# Altium project MRTRUMAN.PrjPcb (part 2 of 4)

## Sheet 03 POWER.SchDoc
size 381 x 228 mm
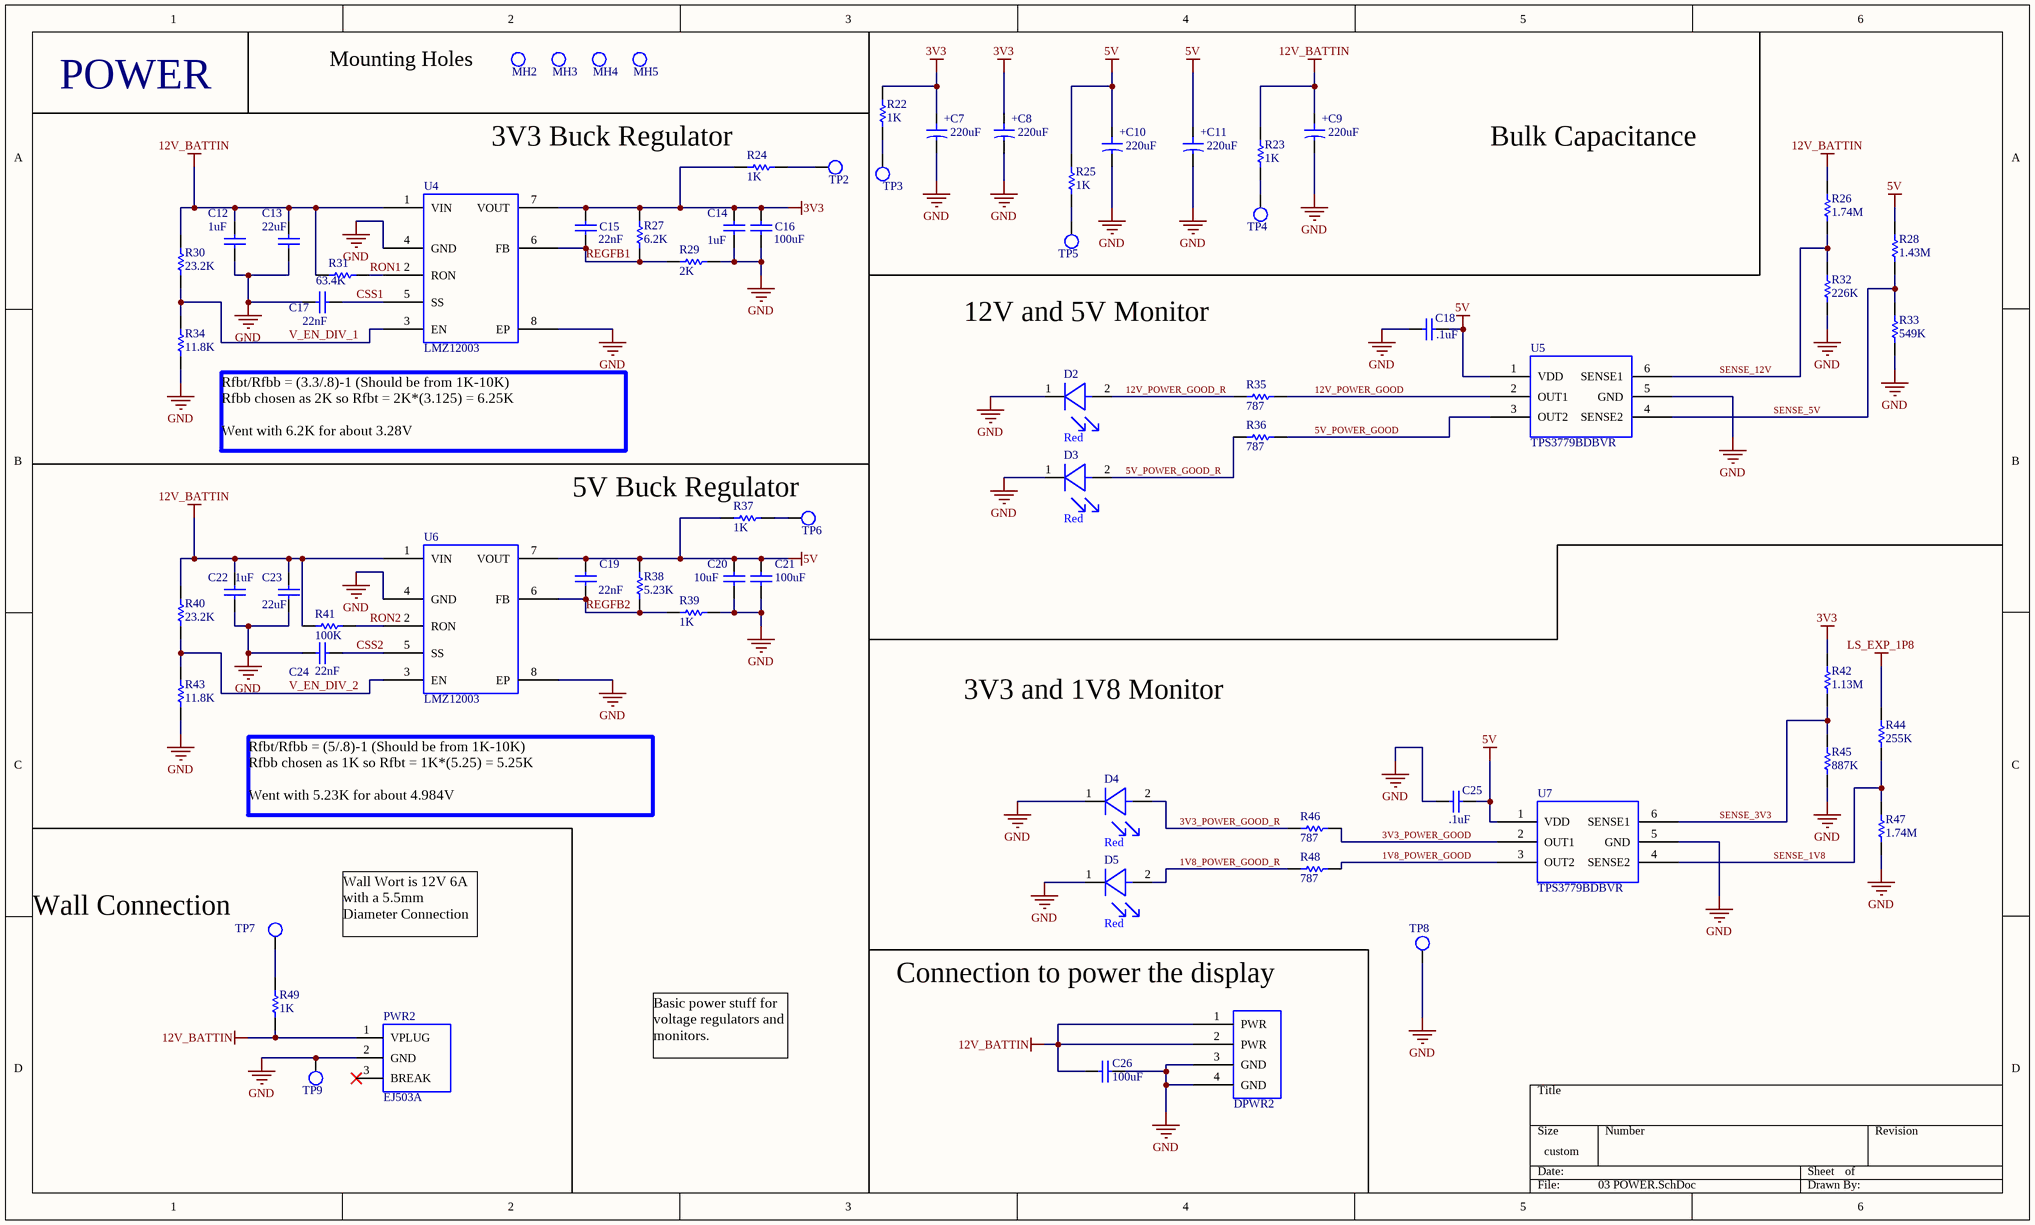
[diagram p2: 03 POWER.SchDoc]

### Parts
C7  Capacitance: 220uF  [CAP_RADIAL]  (hidden comment: CAP ALUM 220UF 20% 25V SMD)
C8  Capacitance: 220uF  [CAP_RADIAL]  (hidden comment: CAP ALUM 220UF 20% 25V SMD)
C9  Capacitance: 220uF  [CAP_RADIAL]  (hidden comment: CAP ALUM 220UF 20% 25V SMD)
C10  Capacitance: 220uF  [CAP_RADIAL]  (hidden comment: CAP ALUM 220UF 20% 25V SMD)
C11  Capacitance: 220uF  [CAP_RADIAL]  (hidden comment: CAP ALUM 220UF 20% 25V SMD)
C12  value 1uF  [CAPC2012X135N]  (hidden comment: CAP_0805_1u_100V)
C13  value 22uF  [CAPC2012X135N]  (hidden comment: CAP_0805_22u_25V)
C14  value 1uF  [CAPC2012X135N]  (hidden comment: CAP_0805_1u_100V)
C15  value 22nF  [CAPC2012X135N]  (hidden comment: CAP_0805_m22n)
C16  value 100uF  [FP_1210]  (hidden comment: CAP_1210_100u_10V)
C17  value 22nF  [CAPC2012X135N]  (hidden comment: CAP_0805_m22n)
C18  value .1uF  [CAPC2012X135N]  (hidden comment: CAP_0805_.1u_250V)
C19  value 22nF  [CAPC2012X135N]  (hidden comment: CAP_0805_m22n)
C20  value 10uF  [CAPC2012X135N]  (hidden comment: CAP_0805_10u_16V)
C21  value 100uF  [FP_1210]  (hidden comment: CAP_1210_100u_10V)
C22  value 1uF  [CAPC2012X135N]  (hidden comment: CAP_0805_1u_100V)
C23  value 22uF  [CAPC2012X135N]  (hidden comment: CAP_0805_22u_25V)
C24  value 22nF  [CAPC2012X135N]  (hidden comment: CAP_0805_m22n)
C25  value .1uF  [CAPC2012X135N]  (hidden comment: CAP_0805_.1u_250V)
C26  value 100uF  [FP_1210]  (hidden comment: CAP_1210_100u_10V)
D2  Color: Red  [POWERLED_FP]  (hidden comment: LED_RED_636nm)
D3  Color: Red  [POWERLED_FP]  (hidden comment: LED_RED_636nm)
D4  Color: Red  [POWERLED_FP]  (hidden comment: LED_RED_636nm)
D5  Color: Red  [POWERLED_FP]  (hidden comment: LED_RED_636nm)
DPWR2  Display_Power  [PHOENIX_4POS_1935187]  (value not drawn)
MH2  MOUNTINGHOLE  [MOUNTINGHOLE]  (value not drawn)
MH3  MOUNTINGHOLE  [MOUNTINGHOLE]  (value not drawn)
MH4  MOUNTINGHOLE  [MOUNTINGHOLE]  (value not drawn)
MH5  MOUNTINGHOLE  [MOUNTINGHOLE]  (value not drawn)
PWR2  EJ503A  [BARRELJACK]
R22  RES_0805_1K  [RES0805]  (value not drawn)
R23  RES_0805_1K  [RES0805]  (value not drawn)
R24  RES_0805_1K  [RES0805]  (value not drawn)
R25  RES_0805_1K  [RES0805]  (value not drawn)
R26  RES_0805_1.74M  [RES0805]  (value not drawn)
R27  RES_6.2K  [RES0805]  (value not drawn)
R28  RES_1.43M  [RES0805]  (value not drawn)
R29  RES_0805_2K  [RES0805]  (value not drawn)
R30  RES_0805_23.2K  [RES0805]  (value not drawn)
R31  RES_63.4K  [RES0805]  (value not drawn)
R32  RES_0805_226K  [RES0805]  (value not drawn)
R33  RES_549K  [RES0805]  (value not drawn)
R34  RES_0805_11.8K  [RES0805]  (value not drawn)
R35  RES_787  [RES0805]  (value not drawn)
R36  RES_787  [RES0805]  (value not drawn)
R37  RES_0805_1K  [RES0805]  (value not drawn)
R38  RES_5.23K  [RES0805]  (value not drawn)
R39  RES_0805_1K  [RES0805]  (value not drawn)
R40  RES_0805_23.2K  [RES0805]  (value not drawn)
R41  RES_0805_100K  [RES0805]  (value not drawn)
R42  RES_1.13M  [RES0805]  (value not drawn)
R43  RES_0805_11.8K  [RES0805]  (value not drawn)
R44  RES_0805_255K  [RES0805]  (value not drawn)
R45  RES_887K  [RES0805]  (value not drawn)
R46  RES_787  [RES0805]  (value not drawn)
R47  RES_0805_1.74M  [RES0805]  (value not drawn)
R48  RES_787  [RES0805]  (value not drawn)
R49  RES_0805_1K  [RES0805]  (value not drawn)
TP2  TP  [TestPoint_0805]  (value not drawn)
TP3  TP  [TestPoint_0805]  (value not drawn)
TP4  TP  [TestPoint_0805]  (value not drawn)
TP5  TP  [TestPoint_0805]  (value not drawn)
TP6  TP  [TestPoint_0805]  (value not drawn)
TP7  TP  [TestPoint_0805]  (value not drawn)
TP8  TP  [TestPoint_0805]  (value not drawn)
TP9  TP  [TestPoint_0805]  (value not drawn)
U4  LMZ12003  [TO-PMOD-7]
U5  TPS3779BDBVR  [DBV (R-PDSO-G6)]
U6  LMZ12003  [TO-PMOD-7]
U7  TPS3779BDBVR  [DBV (R-PDSO-G6)]

### Nets
3V3: C7.1 C8.1 C14.2 C15.2 C16.2 R22.1 R24.2 R27.2 R42.2 U4.7(VOUT)
5V: C10.1 C11.1 C18.2 C19.2 C20.2 C21.2 C25.2 R25.1 R28.2 R37.2 R38.2 U5.1(VDD) U6.7(VOUT) U7.1(VDD)
12V_BATTIN: C9.1 C12.2 C13.2 C22.2 C23.2 C26.1 DPWR2.1(PWR) DPWR2.2(PWR) PWR2.1(VPLUG) R23.1 R26.2 R30.2 R31.1 R40.2 R41.1 R49.1 U4.1(VIN) U6.1(VIN)
GND: C7.2 C8.2 C9.2 C10.2 C11.2 C12.1 C13.1 C14.1 C16.1 C17.1 C18.1 C20.1 C21.1 C22.1 C23.1 C24.1 C25.1 C26.2 D2.1(Cathode) D3.1(Cathode) D4.1(Cathode) D5.1(Cathode) DPWR2.3(GND) DPWR2.4(GND) PWR2.2(GND) R29.2 R32.1 R33.1 R34.1 R39.2 R43.1 R45.1 R47.1 TP8.1 TP9.1 U4.4(GND) U4.8(EP) U5.5(GND) U6.4(GND) U6.8(EP) U7.5(GND)
LS_EXP_1P8: R44.2
1V8_POWER_GOOD: R48.1 U7.3(OUT2)
1V8_POWER_GOOD_R: D5.2(Anode) R48.2
3V3_POWER_GOOD: R46.1 U7.2(OUT1)
3V3_POWER_GOOD_R: D4.2(Anode) R46.2
5V_POWER_GOOD: R36.2 U5.3(OUT2)
5V_POWER_GOOD_R: D3.2(Anode) R36.1
12V_POWER_GOOD: R35.2 U5.2(OUT1)
12V_POWER_GOOD_R: D2.2(Anode) R35.1
CSS1: C17.2 U4.5(SS)
CSS2: C24.2 U6.5(SS)
REGFB1: C15.1 R27.1 R29.1 U4.6(FB)
REGFB2: C19.1 R38.1 R39.1 U6.6(FB)
RON1: R31.2 U4.2(RON)
RON2: R41.2 U6.2(RON)
SENSE_1V8: R44.1 R47.2 U7.4(SENSE2)
SENSE_3V3: R42.1 R45.2 U7.6(SENSE1)
SENSE_5V: R28.1 R33.2 U5.4(SENSE2)
SENSE_12V: R26.1 R32.2 U5.6(SENSE1)
V_EN_DIV_1: R30.1 R34.2 U4.3(EN)
V_EN_DIV_2: R40.1 R43.2 U6.3(EN)
NetR22_2: R22.2 TP3.1
NetR23_2: R23.2 TP4.1
NetR24_1: R24.1 TP2.1
NetR25_2: R25.2 TP5.1
NetR37_1: R37.1 TP6.1
NetR49_2: R49.2 TP7.1

Not connected (* = marked no-connect by the designer): PWR2 3(BREAK)*

### Notes on the sheet
- POWER
- (near MH2) Mounting Holes
- (near R24) 3V3 Buck Regulator
- Bulk Capacitance
- 12V and 5V Monitor
- Rfbt/Rfbb = (3.3/.8)-1 (Should be from 1K-10K)
  Rfbb chosen as 2K so Rfbt = 2K*(3.125) = 6.25K
  Went with 6.2K for about 3.28V
- 5V Buck Regulator
- 3V3 and 1V8 Monitor
- Rfbt/Rfbb = (5/.8)-1 (Should be from 1K-10K)
  Rfbb chosen as 1K so Rfbt = 1K*(5.25) = 5.25K
  Went with 5.23K for about 4.984V
- (near TP7) Wall Connection
- Wall Wort is 12V 6A with a 5.5mm Diameter Connection
- (near DPWR2) Connection to power the display
- Basic power stuff for voltage regulators and monitors.
- (in symbol CAP_RAD_220u_25V) +
- (in symbol RES_0805_1.13M) 1.13M
- (in symbol RES_0805_1.43M) 1.43M
- (in symbol RES_0805_1.74M) 1.74M
- (in symbol RES_0805_1K) 1K
- (in symbol RES_0805_2K) 2K
- (in symbol RES_0805_5.23K) 5.23K
- (in symbol RES_0805_6.2K) 6.2K
- (in symbol RES_0805_11.8K) 11.8K
- (in symbol RES_0805_23.2K) 23.2K
- (in symbol RES_0805_63.4K) 63.4K
- (in symbol RES_0805_100K) 100K
- (in symbol RES_0805_226K) 226K
- (in symbol RES_0805_255K) 255K
- (in symbol RES_0805_549K) 549K
- (in symbol RES_0805_787) 787
- (in symbol RES_0805_887K) 887K

### Library data of the parts
C7-C11 = CAP_RAD_220u_25V: Manufacturer: Nichicon; Manufacturer Part Number: UWT1E221MNL1GS; Dielectric Material: Aluminium; Ripple Current: 155mA; Leakage Current: 3uA; Life (Hours): 1000Hour; Dissipation Factor: 0.16%; Supplier 1: Digi-Key; Stock 1: 22315; Pricing 1: 1=0.44, 10=0.309, 100=0.2034 (USD); Mount: Surface Mount; Case/Package: SMD/SMT; Number of Pins: 2; Min Operating Temperature: -55°C; Max Operating Temperature: 105°C; Tolerance: 20%; Package Quantity: 500; Voltage Rating: 25V; Packaging: Tape and Reel; Ripple Current (AC): 155mA; Voltage Rating (DC): 25V; Termination: SMD/SMT; Voltage: 25V; Diameter: 8mm; Length: 10mm; Height: 10mm; Height - Seated (Max): 0.394inch; Lead Pitch: 3.1mm; Radiation Hardening: No; REACH SVHC: No SVHC; Lead Free: Lead Free; ComponentLink1URL: https://datasheet.ciiva.com/97/e-wt-97056.pdf; ComponentLink1Description: https://datasheet.ciiva.com/97/e-wt-97056.pdf; ComponentLink2URL: https://datasheet.ciiva.com/97/e-wt-97057.pdf; ComponentLink2Description: https://datasheet.ciiva.com/97/e-wt-97057.pdf; ComponentLink3URL: https://datasheet.ciiva.com/30522/getdatasheetpartid-450026-30522226.pdf; ComponentLink3Description: https://datasheet.ciiva.com/30522/getdatasheetpartid-450026-30522226.pdf; ComponentLink4URL: https://datasheet.ciiva.com/5360/e-wt-30307-5360729.pdf; ComponentLink4Description: https://datasheet.ciiva.com/5360/e-wt-30307-5360729.pdf; ComponentLink5URL: https://datasheet.ciiva.com/7851/e-wt-7851755.pdf; ComponentLink5Description: https://datasheet.ciiva.com/7851/e-wt-7851755.pdf; ComponentLink6URL: https://datasheet.ciiva.com/17526/e-wt-17526956.pdf; ComponentLink6Description: https://datasheet.ciiva.com/17526/e-wt-17526956.pdf; ComponentLink7URL: https://datasheet.ciiva.com/28458/1910938-28458412.pdf; ComponentLink7Description: https://datasheet.ciiva.com/28458/1910938-28458412.pdf; ComponentLink8URL: https://datasheet.ciiva.com/97/e-wt-97055.pdf; ComponentLink8Description: https://datasheet.ciiva.com/97/e-wt-97055.pdf; Supplier Part Number 1: 493-2192-1-ND
C12 C14 C22 = CAP_0805_1u_100V: CAP CER 1UF 100V X7S 0805; Manufacturer: TDK; Manufacturer Part Number: C2012X7S2A105K125AE; Tolerance: 10%; Supplier 1: Digi-Key; Supplier Part Number 1: 445-8887-1-ND; Stock 1: 75778; Pricing 1: 1=0.46, 10=0.327, 100=0.2152, 500=0.1594, 1000=0.1355 (USD); Case/Package: 0805; Case Code (Metric): 2012; Case Code (Imperial): 0805; Min Operating Temperature: -55°C; Max Operating Temperature: 125°C; Package Quantity: 1; Capacitance: 1uF; Voltage Rating: 100V; Packaging: Tape and Reel; Voltage Rating (DC): 100V; Dielectric: X7S; Termination: SMD/SMT; Composition: Ceramic; Length: 2mm; Height: 1.25mm; Width: 0.05inch; Thickness: 0.049inch; Depth: 1.25mm; Lead Free: Lead Free; ComponentLink1URL: https://datasheet.ciiva.com/6252/mlcc-commercial-soft-en-6252535.pdf; ComponentLink1Description: https://datasheet.ciiva.com/6252/mlcc-commercial-soft-en-6252535.pdf; ComponentLink2URL: https://datasheet.ciiva.com/6252/mlcc-commercial-soft-en-6252538.pdf; ComponentLink2Description: https://datasheet.ciiva.com/6252/mlcc-commercial-soft-en-6252538.pdf; ComponentLink3URL: https://datasheet.ciiva.com/6252/mlcc-commercial-soft-en-6252540.pdf; ComponentLink3Description: https://datasheet.ciiva.com/6252/mlcc-commercial-soft-en-6252540.pdf; ComponentLink4URL: https://datasheet.ciiva.com/24219/c2012x7s2a105k125ae-265181-24219982.pdf; ComponentLink4Description: https://datasheet.ciiva.com/24219/c2012x7s2a105k125ae-265181-24219982.pdf
C13 C23 = CAP_0805_22u_25V: 22µF ±20% 25V X5R Ceramic Capacitor -55°C ~ 85°C Surface Mount, MLCC 0805 (2012 Metric) 0.079" L x 0.049" W (2.00mm x 1.25mm); Manufacturer: Samsung; Manufacturer Part Number: CL21A226MAQNNNE; Supplier 1: Digi-Key; Supplier Part Number 1: 1276-2908-1-ND; Stock 1: 536403; Pricing 1: 1=0.92, 10=0.678, 100=0.465, 500=0.3681, 1000=0.31 (USD); Mount: Surface Mount; Case/Package: 0805; Case Code (Metric): 2012; Case Code (Imperial): 0805; Contact Plating: Nickel,Tin; Min Operating Temperature: -55°C; Max Operating Temperature: 85°C; Package Quantity: 1; Packaging: Tape and Reel; Capacitance: 22uF; Tolerance: 20%; Voltage Rating: 25V; Dielectric: X5R; Termination: Wraparound; Length: 2mm; Width: 0.049inch; Thickness: 0.055inch; Depth: 1.25mm; ComponentLink1URL: https://datasheet.ciiva.com/25724/cl21a226maqnnne-25724468.pdf; ComponentLink1Description: https://datasheet.ciiva.com/25724/cl21a226maqnnne-25724468.pdf
C15 C17 C19 C24 = CAP_0805_22n_100V: CAP CER 0.022UF 100V X7R 0805; Manufacturer: TDK; Manufacturer Part Number: CGJ4J2X7R2A223K125AA; Tolerance: 10%; Supplier 1: Digi-Key; Supplier Part Number 1: 445-9184-1-ND; Stock 1: 2508; Pricing 1: 1=0.42, 10=0.292, 100=0.175, 500=0.1312, 1000=0.1108 (USD); Case/Package: 0805; Weight: 0.000194oz; Case Code (Metric): 2012; Case Code (Imperial): 0805; Min Operating Temperature: -55°C; Max Operating Temperature: 125°C; Package Quantity: 1; Capacitance: 22nF; Voltage Rating: 100V; Packaging: Tape and Reel; Voltage Rating (DC): 100V; Dielectric: X7R; Termination: SMD/SMT; Composition: Ceramic; Length: 0.08inch; Height: 1.25mm; Width: 0.05inch; Thickness: 0.057inch; ComponentLink1URL: http://www.mouser.com/ds/2/400/lcc_highreliability_midvoltage_en-520194.pdf; ComponentLink1Description: http://www.mouser.com/ds/2/400/lcc_highreliability_midvoltage_en-520194.pdf; ComponentLink2URL: http://product.tdk.com/capacitor/mlcc/en/documents/mlccspec_highreliability_en.pdf; ComponentLink2Description: http://product.tdk.com/capacitor/mlcc/en/documents/mlccspec_highreliability_en.pdf
C16 C21 C26 = CAP_1210_100u_10V: Cap Ceramic 100uF 10V X5R 20% SMD 1210 85C Embossed T/R; Manufacturer: Murata; Manufacturer Part Number: GRM32ER61A107ME20L; Dissipation Factor: 0.035%; Supplier 1: Digi-Key; Supplier Part Number 1: 490-9969-1-ND; Stock 1: 195702; Pricing 1: 1=1.08, 10=0.822, 100=0.5882, 500=0.4554 (USD); Case/Package: 1210; Weight: 0.00388oz; Case Code (Metric): 3225; Material: Ceramic; Case Code (Imperial): 1210; Dielectric Material: Ceramic; Min Operating Temperature: -55°C; Max Operating Temperature: 85°C; Capacitance: 100uF; Tolerance: 20%; Packaging: Tape and Reel; Dielectric: X5R; Voltage Rating: 10V; Voltage: 10V; Termination: SMD/SMT; Voltage Rating (DC): 10V; Package Quantity: 1000; Length: 3.2mm; Height: 2.5mm; Width: 2.5mm; Thickness: 0.106inch; Depth: 2.5mm; REACH SVHC: No SVHC; Lead Free: Lead Free; ComponentLink1URL: http://components.arrow.com/part/dataview/0323_06932945; ComponentLink1Description: http://components.arrow.com/part/dataview/0323_06932945; ComponentLink2URL: http://www.mouser.com/ds/2/281/c02e-2905.pdf; ComponentLink2Description: http://www.mouser.com/ds/2/281/c02e-2905.pdf; ComponentLink3URL: http://www.farnell.com/datasheets/2079200.pdf; ComponentLink3Description: http://www.farnell.com/datasheets/2079200.pdf; ComponentLink4URL: http://psearch.en.murata.com/capacitor/product/GRM32ER61A107ME20%23.pdf; ComponentLink4Description: http://psearch.en.murata.com/capacitor/product/GRM32ER61A107ME20%23.pdf
C18 C25 = CAP_0805_.1u_250V: Cap Ceramic 0.1uF 250V X7T 10% SMD 0805 125C Plastic T/R; Manufacturer: TDK; Manufacturer Part Number: C2012X7T2E104K125AE; Capacitance: 100nF; Supplier 1: Digi-Key; Supplier Part Number 1: 445-8883-1-ND; Stock 1: 30376; Pricing 1: 1=0.37, 10=0.25, 100=0.1419, 500=0.1002, 1000=0.0877 (USD); Case/Package: 0805; Weight: 0.000194oz; Case Code (Metric): 2012; Case Code (Imperial): 0805; Min Operating Temperature: -55°C; Max Operating Temperature: 125°C; Package Quantity: 1; Voltage Rating: 250V; Tolerance: 10%; Packaging: Tape and Reel; Voltage Rating (DC): 250V; Dielectric: X7T; Termination: SMD/SMT; Composition: Ceramic; Length: 2mm; Height: 1.25mm; Width: 0.05inch; Thickness: 0.049inch; Depth: 1.25mm; REACH SVHC: No SVHC; ComponentLink1URL: https://datasheet.ciiva.com/24219/c2012x7t2e104k125ae-265154-24219519.pdf; ComponentLink1Description: https://datasheet.ciiva.com/24219/c2012x7t2e104k125ae-265154-24219519.pdf
C20 = CAP_0805_10u_16V: Cap Ceramic 10uF 16V X5R 10% SMD 0805 85C T/R; Manufacturer: Johanson Dielectrics; Manufacturer Part Number: 160R15X106KV4E; Supplier 1: Digi-Key; Supplier Part Number 1: 709-1229-1-ND; Stock 1: 36636; Pricing 1: 1=0.55, 10=0.387, 100=0.2552, 500=0.189, 1000=0.1607 (USD); Mount: Surface Mount; Case/Package: 0805; Number of Pins: 2; Weight: 0.000194oz; Case Code (Imperial): 0805; Case Code (Metric): 2012; Min Operating Temperature: -55°C; Max Operating Temperature: 85°C; Voltage Rating: 16V; Capacitance: 10uF; Voltage Rating (DC): 16V; Tolerance: 10%; Packaging: Tape and Reel; Package Quantity: 2000; Dielectric: X5R; Termination: SMD/SMT; Length: 2.03mm; Height: 1.27mm; Width: 1.27mm; Thickness: 0.06inch; Depth: 1.27mm; Radiation Hardening: No; REACH SVHC: No SVHC; ComponentLink1URL: https://datasheet.ciiva.com/26948/getdatasheetpartid-132904-26948555.pdf; ComponentLink1Description: https://datasheet.ciiva.com/26948/getdatasheetpartid-132904-26948555.pdf
D2-D5 = LED_RED_636nm: Standard LEDs - SMD Surface Mount LEDs; Manufacturer: Lumex; Manufacturer Part Number: SML-LXR85SIC-TR; Lens Colour: Colorless; Viewing Angle: 160°; Forward Current: 20mA; Forward Voltage: 2V; Power Rating: 80mW; Luminous Intensity: 70mcd; Lens Transparency: Clear; Wavelength: 636nm; Supplier 1: Digi-Key; Supplier Part Number 1: 67-1710-1-ND; Stock 1: 10351; Pricing 1: 1=0.64, 10=0.502, 25=0.4184, 100=0.3604, 250=0.3218, 500=0.2767, 1000=0.2136 (USD); Mount: Surface Mount; Case/Package: SMD/SMT; Number of Pins: 2; Colour: Red; Min Operating Temperature: -25°C; Max Operating Temperature: 85°C; Package Quantity: 1; Packaging: Tape and Reel; Illumination Colour: Red; Test Current: 20mA; Length: 3.2mm; Height: 1mm; Width: 1.5mm; Lead Free: Lead Free; ComponentLink1URL: https://datasheet.ciiva.com/2111/sml-lxr85sic-tr-2111364.pdf; ComponentLink1Description: https://datasheet.ciiva.com/2111/sml-lxr85sic-tr-2111364.pdf; ComponentLink2URL: https://datasheet.ciiva.com/2111/sml-lxr85sic-tr-2111365.pdf; ComponentLink2Description: https://datasheet.ciiva.com/2111/sml-lxr85sic-tr-2111365.pdf; ComponentLink3URL: https://datasheet.ciiva.com/2111/sml-lxr85sic-tr-2111366.pdf; ComponentLink3Description: https://datasheet.ciiva.com/2111/sml-lxr85sic-tr-2111366.pdf; ComponentLink4URL: https://datasheet.ciiva.com/4688/sml-lxr85sic-tr-115543-4688938.pdf; ComponentLink4Description: https://datasheet.ciiva.com/4688/sml-lxr85sic-tr-115543-4688938.pdf
DPWR2 = Display_Power: 4 Position Thru Hole Connection; Manufacturer: Phoenix Contact; Manufacturer Part Number: 1935187; Max Current Rating: 16A; Number of Poles: 4; Voltage Rating: 250V; Number of Levels: 1; Current: 18A; Voltage: 300V; Voltage Rating (DC): 508mV; Wire Gauge (Max): 26AWG; Wire Gauge (Min): 12AWG; Pitch: 5mm; Wire/Cable Gauge: 14AWG; Approvals: UL; Supplier 1: Digi-Key; Stock 1: 5969; Pricing 1: 1=0.77, 10=0.736, 50=0.704, 100=0.6848, 250=0.64, 500=0.5888, 1000=0.544 (USD); Mount: Through Hole; Weight: 0.134041oz; Colour: Green; Material: Nylon; Housing Colour: Green; Housing Material: Polyamide; Insulation Material: Nylon; Current Rating: 16A; Package Quantity: 250; Number of Rows: 1; Max Supply Voltage: 250V; Packaging: Bulk; Termination: Screw; Number of Positions Per Level: 4; Number of Contacts: 4; Number of Circuits: 4; Orientation: Straight; Number of Positions: 4; Length: 20mm; Height: 11.3mm; Width: 15mm; Depth: 9mm; Radiation Hardening: No; Lead Free: Lead Free; Flammability Rating: UL94 V-0; ComponentLink1URL: https://datasheet.ciiva.com/16047/1935187-16047251.pdf; ComponentLink1Description: https://datasheet.ciiva.com/16047/1935187-16047251.pdf; ComponentLink2URL: https://datasheet.ciiva.com/823/combiconcompact5-0mmseries-823770.pdf; ComponentLink2Description: https://datasheet.ciiva.com/823/combiconcompact5-0mmseries-823770.pdf; Supplier Part Number 1: 277-1579-ND
MH2-MH5 = MOUNTINGHOLE: Mounting Hole For Board
PWR2 = EJ503A: DC Barrel Jack 2.1mm x 5.5mm 12V 5A; Manufacturer: Memory Protection Devices; Supplier 1: Digi-Key; Manufacturer Part Number: EJ503A; Stock 1: 0; Supplier Part Number 1: EJ503A-ND
R22-R25 R37 R39 R49 = RES_0805_1K: RES SMD 1K OHM 1% 1/8W 0805; Manufacturer: Yageo; Manufacturer Part Number: RC0805FR-071KL; Resistance: 1KR; Temperature Coefficient: 100ppm/°C; Voltage Rating (DC): 150V; Power Rating: 125mW; Supplier 1: Digi-Key; Supplier Part Number 1: 311-1.00KCRCT-ND; Stock 1: 6122451; Pricing 1: 1=0.1, 10=0.022, 100=0.0088, 1000=0.004, 2500=0.0034 (USD); Case/Package: 0805; Number of Pins: 2; Case Code (Metric): 2012; Case Code (Imperial): 0805; Min Operating Temperature: -55°C; Max Operating Temperature: 155°C; Tolerance: 1%; Packaging: Tape and Reel; Composition: Thick Film; Package Quantity: 1; Voltage Rating: 150V; Number of Terminations: 2; Termination: SMD/SMT; Military Standard: Not; Max Power Dissipation: 125mW; Length: 0.079inch; Height: 0.024inch; Width: 0.049inch; Depth: 1.25mm; REACH SVHC: Unknown; Lead Free: Lead Free; ComponentLink1URL: https://datasheet.ciiva.com/2456/pyu-r-int-thick-7-2456976.pdf; ComponentLink1Description: https://datasheet.ciiva.com/2456/pyu-r-int-thick-7-2456976.pdf; ComponentLink2URL: https://datasheet.ciiva.com/2456/pyu-r-int-thick-7-2456977.pdf; ComponentLink2Description: https://datasheet.ciiva.com/2456/pyu-r-int-thick-7-2456977.pdf; ComponentLink3URL: https://datasheet.ciiva.com/11819/0900766b8106beab-11819814.pdf; ComponentLink3Description: https://datasheet.ciiva.com/11819/0900766b8106beab-11819814.pdf; ComponentLink4URL: https://datasheet.ciiva.com/7941/1686128-7941719.pdf; ComponentLink4Description: https://datasheet.ciiva.com/7941/1686128-7941719.pdf; ComponentLink5URL: https://datasheet.ciiva.com/16850/rc0805-16850409.pdf; ComponentLink5Description: https://datasheet.ciiva.com/16850/rc0805-16850409.pdf; ComponentLink6URL: https://datasheet.ciiva.com/46385/444164-46385020.pdf; ComponentLink6Description: https://datasheet.ciiva.com/46385/444164-46385020.pdf; ComponentLink7URL: https://datasheet.ciiva.com/2456/pyu-r-int-thick-7-2456975.pdf; ComponentLink7Description: https://datasheet.ciiva.com/2456/pyu-r-int-thick-7-2456975.pdf
R26 R47 = RES_0805_1.74M: RES SMD 1.74M OHM 1% 1/8W 0805; Manufacturer: Yageo; Manufacturer Part Number: RC0805FR-071M74L; Resistance: 1.74MR; Power Rating: 125mW; Voltage Rating: 150V; Temperature Coefficient: 100ppm/°C; Supplier 1: Digi-Key; Supplier Part Number 1: 311-1.74MCRCT-ND; Stock 1: 24001; Pricing 1: 1=0.1, 10=0.023, 100=0.0095, 1000=0.0043, 2500=0.0037 (USD); Case/Package: 0805; Case Code (Imperial): 0805; Case Code (Metric): 2012; Contact Plating: Tin,Matte; Min Operating Temperature: -55°C; Max Operating Temperature: 155°C; Tolerance: 1%; Packaging: Tape and Reel; Package Quantity: 1; Termination: SMD/SMT; Composition: Thick Film; Number of Terminations: 2; Max Power Dissipation: 125mW; Voltage Rating (DC): 150V; Length: 0.079inch; Height: 0.024inch; Width: 1.25mm; Radiation Hardening: No; Lead Free: Lead Free; ComponentLink1URL: https://datasheet.ciiva.com/12575/rc0805-257173-12575526.pdf; ComponentLink1Description: https://datasheet.ciiva.com/12575/rc0805-257173-12575526.pdf; ComponentLink2URL: https://datasheet.ciiva.com/2459/pyu-r-int-thick-7-2459082.pdf; ComponentLink2Description: https://datasheet.ciiva.com/2459/pyu-r-int-thick-7-2459082.pdf; ComponentLink3URL: https://datasheet.ciiva.com/2459/pyu-r-int-thick-7-2459083.pdf; ComponentLink3Description: https://datasheet.ciiva.com/2459/pyu-r-int-thick-7-2459083.pdf; ComponentLink4URL: https://datasheet.ciiva.com/2459/pyu-r-int-thick-7-2459084.pdf; ComponentLink4Description: https://datasheet.ciiva.com/2459/pyu-r-int-thick-7-2459084.pdf
R27 = RES_0805_6.2K: Yageo RC0805 Series Thick Film Surface Mount Resistor 0805 Case 6.2k 1% 0.125W 100ppm/C; Manufacturer Part Number: RC0805FR-076K2L; Power Rating: 125mW; Resistance: 6.2KR; Temperature Coefficient: 100ppm/°C; Voltage Rating (DC): 150V; Supplier 1: Digi-Key; Supplier Part Number 1: 311-6.20KCRCT-ND; Manufacturer: Yageo; Stock 1: 195580; Pricing 1: 1=0.1, 10=0.022, 100=0.0088, 1000=0.004, 2500=0.0034 (USD); Case/Package: 0805; Case Code (Imperial): 0805; Case Code (Metric): 2012; Min Operating Temperature: -55°C; Max Operating Temperature: 155°C; Tolerance: 1%; Packaging: Tape and Reel; Package Quantity: 5000; Voltage Rating: 150V; Termination: SMD/SMT; Military Standard: Not; Composition: Thick Film; Length: 2mm; Height: 0.5mm; Width: 1.25mm; Depth: 1.25mm; Lead Free: Lead Free; ComponentLink1URL: https://datasheet.ciiva.com/11809/0900766b8106beab-11809424.pdf; ComponentLink1Description: https://datasheet.ciiva.com/11809/0900766b8106beab-11809424.pdf; ComponentLink2URL: https://datasheet.ciiva.com/16792/rc0805-16792360.pdf; ComponentLink2Description: https://datasheet.ciiva.com/16792/rc0805-16792360.pdf
R28 = RES_0805_1.43M: RES SMD 1.43M OHM 1% 1/8W 0805; Manufacturer: Yageo; Manufacturer Part Number: RC0805FR-071M43L; Voltage Rating: 150V; Resistance: 1.43MR; Power Rating: 125mW; Temperature Coefficient: 100ppm/°C; Supplier 1: Digi-Key; Supplier Part Number 1: 311-1.43MCRCT-ND; Stock 1: 27474; Pricing 1: 1=0.1, 10=0.023, 100=0.0095, 1000=0.0043, 2500=0.0037 (USD); Case/Package: 0805; Case Code (Metric): 2012; Case Code (Imperial): 0805; Contact Plating: Tin,Matte; Min Operating Temperature: -55°C; Max Operating Temperature: 155°C; Package Quantity: 1; Tolerance: 1%; Packaging: Tape and Reel; Composition: Thick Film; Number of Terminations: 2; Termination: SMD/SMT; Military Standard: Not; Max Power Dissipation: 125mW; Voltage Rating (DC): 150V; Length: 2mm; Height: 0.024inch; Width: 0.049inch; Depth: 1.25mm; Radiation Hardening: No; Lead Free: Lead Free; ComponentLink1URL: https://datasheet.ciiva.com/2554/pyu-r-int-thick-7-2554432.pdf; ComponentLink1Description: https://datasheet.ciiva.com/2554/pyu-r-int-thick-7-2554432.pdf; ComponentLink2URL: https://datasheet.ciiva.com/12575/rc0805-257173-12575317.pdf; ComponentLink2Description: https://datasheet.ciiva.com/12575/rc0805-257173-12575317.pdf; ComponentLink3URL: https://datasheet.ciiva.com/2554/pyu-r-int-thick-7-2554430.pdf; ComponentLink3Description: https://datasheet.ciiva.com/2554/pyu-r-int-thick-7-2554430.pdf; ComponentLink4URL: https://datasheet.ciiva.com/2554/pyu-r-int-thick-7-2554431.pdf; ComponentLink4Description: https://datasheet.ciiva.com/2554/pyu-r-int-thick-7-2554431.pdf
R29 = RES_0805_2K: RES SMD 2K OHM 5% 1/8W 0805; Manufacturer: Yageo; Manufacturer Part Number: RC0805JR-072KL; Resistance: 2KR; Power Rating: 125mW; Voltage Rating: 150V; Temperature Coefficient: 100ppm/°C; Supplier 1: Digi-Key; Supplier Part Number 1: 311-2.0KARCT-ND; Stock 1: 297667; Pricing 1: 1=0.1, 10=0.016, 25=0.0116, 50=0.009, 100=0.0066, 250=0.005, 500=0.004, 1000=0.003 (USD); Case/Package: 0805; Number of Pins: 2; Case Code (Metric): 2012; Case Code (Imperial): 0805; Contact Plating: Tin,Lead,Matte; Min Operating Temperature: -55°C; Max Operating Temperature: 155°C; Tolerance: 5%; Packaging: Tape and Reel; Package Quantity: 1; Composition: Thick Film; Number of Terminations: 2; Termination: SMD/SMT; Military Standard: Not; Max Power Dissipation: 125mW; Voltage Rating (DC): 150V; Length: 2mm; Height: 0.024inch; Width: 0.049inch; Depth: 1.25mm; Radiation Hardening: No; REACH SVHC: No SVHC; Lead Free: Lead Free; ComponentLink1URL: https://datasheet.ciiva.com/46395/444164-46395141.pdf; ComponentLink1Description: https://datasheet.ciiva.com/46395/444164-46395141.pdf; ComponentLink2URL: https://datasheet.ciiva.com/2456/pyu-r-int-thick-7-2456104.pdf; ComponentLink2Description: https://datasheet.ciiva.com/2456/pyu-r-int-thick-7-2456104.pdf; ComponentLink3URL: https://datasheet.ciiva.com/2456/pyu-r-int-thick-7-2456105.pdf; ComponentLink3Description: https://datasheet.ciiva.com/2456/pyu-r-int-thick-7-2456105.pdf; ComponentLink4URL: https://datasheet.ciiva.com/2456/pyu-r-int-thick-7-2456106.pdf; ComponentLink4Description: https://datasheet.ciiva.com/2456/pyu-r-int-thick-7-2456106.pdf; ComponentLink5URL: https://datasheet.ciiva.com/12666/rc0805-12666941.pdf; ComponentLink5Description: https://datasheet.ciiva.com/12666/rc0805-12666941.pdf
R30 R40 = RES_0805_23.2K: RESISTOR, THICK FILM, 23.2KOHM, 125mW, ± 1%; Manufacturer: Panasonic ECG; Manufacturer Part Number: ERJ-6ENF2322V; Resistance: 23.2KR; Voltage Rating: 150V; Temperature Coefficient: 100ppm/°C; Supplier 1: Digi-Key; Supplier Part Number 1: P23.2KCCT-ND; Stock 1: 76814; Pricing 1: 1=0.1, 10=0.041, 100=0.0167, 1000=0.0075, 2500=0.0065 (USD); Mount: Surface Mount; Case/Package: 0805; Case Code (Metric): 2012; Case Code (Imperial): 0805; Contact Plating: Tin; Min Operating Temperature: -55°C; Max Operating Temperature: 155°C; Tolerance: 1%; Power Rating: 125mW; Packaging: Tape and Reel; Package Quantity: 1; Composition: Thick Film; Number of Terminations: 2; Termination: Solder; Military Standard: Not; Max Power Dissipation: 125mW; Voltage Rating (DC): 150V; Length: 2mm; Height: 0.6mm; Width: 0.049inch; Depth: 1.25mm; REACH SVHC: Unknown; Lead Free: Lead Free; ComponentLink1URL: https://datasheet.ciiva.com/16766/70260748-16766008.pdf; ComponentLink1Description: https://datasheet.ciiva.com/16766/70260748-16766008.pdf; ComponentLink2URL: https://datasheet.ciiva.com/16770/70260748-16770232.pdf; ComponentLink2Description: https://datasheet.ciiva.com/16770/70260748-16770232.pdf; ComponentLink3URL: https://datasheet.ciiva.com/24026/aoa0000ce2-24026235.pdf; ComponentLink3Description: https://datasheet.ciiva.com/24026/aoa0000ce2-24026235.pdf; ComponentLink4URL: https://datasheet.ciiva.com/15829/aoa0000ce2-15829836.pdf; ComponentLink4Description: https://datasheet.ciiva.com/15829/aoa0000ce2-15829836.pdf; ComponentLink5URL: https://datasheet.ciiva.com/30086/aoa0000ce2-30086557.pdf; ComponentLink5Description: https://datasheet.ciiva.com/30086/aoa0000ce2-30086557.pdf; ComponentLink6URL: https://datasheet.ciiva.com/28548/1694929-28548334.pdf; ComponentLink6Description: https://datasheet.ciiva.com/28548/1694929-28548334.pdf; ComponentLink7URL: https://datasheet.ciiva.com/7870/aoa0000ce2-7870831.pdf; ComponentLink7Description: https://datasheet.ciiva.com/7870/aoa0000ce2-7870831.pdf
R31 = RES_0805_63.4K: RES SMD 63.4K OHM 1% 1/8W 0805; Manufacturer: Yageo; Manufacturer Part Number: RC0805FR-0763K4L; Resistance: 63.4KR; Power Rating: 125mW; Voltage Rating: 150V; Temperature Coefficient: 100ppm/°C; Supplier 1: Digi-Key; Supplier Part Number 1: 311-63.4KCRCT-ND; Stock 1: 27; Pricing 1: 1=0.1, 10=0.021, 25=0.0152, 100=0.0084, 250=0.0064, 500=0.0051, 1000=0.0038, 2500=0.0033 (USD); Case/Package: 0805; Case Code (Metric): 2012; Case Code (Imperial): 0805; Contact Plating: Tin,Matte; Min Operating Temperature: -55°C; Max Operating Temperature: 155°C; Tolerance: 1%; Packaging: Tape and Reel; Composition: Thick Film; Termination: SMD/SMT; Military Standard: Not; Voltage Rating (DC): 150V; Package Quantity: 1; Number of Terminations: 2; Max Power Dissipation: 125mW; Length: 2mm; Height: 0.024inch; Width: 0.049inch; Depth: 1.25mm; Radiation Hardening: No; Lead Free: Lead Free; ComponentLink1URL: https://datasheet.ciiva.com/2519/pyu-r-int-thick-7-2519699.pdf; ComponentLink1Description: https://datasheet.ciiva.com/2519/pyu-r-int-thick-7-2519699.pdf; ComponentLink2URL: https://datasheet.ciiva.com/2519/pyu-r-int-thick-7-2519700.pdf; ComponentLink2Description: https://datasheet.ciiva.com/2519/pyu-r-int-thick-7-2519700.pdf; ComponentLink3URL: https://datasheet.ciiva.com/2519/pyu-r-int-thick-7-2519701.pdf; ComponentLink3Description: https://datasheet.ciiva.com/2519/pyu-r-int-thick-7-2519701.pdf
R32 = RES_0805_226K: Res Thick Film 0805 226K Ohm 1% 1/8W ±100ppm/C Molded SMD Punched Carrier T/R; Manufacturer: Panasonic ECG; Manufacturer Part Number: ERJ-6ENF2263V; Resistance: 226KR; Power Rating: 125mW; Voltage Rating: 150V; Temperature Coefficient: 100ppm/°C; Supplier 1: Digi-Key; Supplier Part Number 1: P226KCCT-ND; Stock 1: 16885; Pricing 1: 1=0.1, 10=0.041, 100=0.0167, 1000=0.0075, 2500=0.0065 (USD); Mount: Surface Mount; Case/Package: 0805; Case Code (Metric): 2012; Case Code (Imperial): 0805; Contact Plating: Tin; Min Operating Temperature: -55°C; Max Operating Temperature: 155°C; Tolerance: 1%; Packaging: Tape and Reel; Package Quantity: 5000; Composition: Thick Film; Number of Terminations: 2; Military Standard: Not; Max Power Dissipation: 125mW; Voltage Rating (DC): 150V; Length: 2mm; Height: 0.028inch; Width: 0.049inch; Depth: 1.25mm; REACH SVHC: No SVHC; Lead Free: Lead Free; ComponentLink1URL: https://datasheet.ciiva.com/22673/1678782-22673814.pdf; ComponentLink1Description: https://datasheet.ciiva.com/22673/1678782-22673814.pdf; ComponentLink2URL: https://datasheet.ciiva.com/30142/aoa0000ce2-30142390.pdf; ComponentLink2Description: https://datasheet.ciiva.com/30142/aoa0000ce2-30142390.pdf; ComponentLink3URL: https://datasheet.ciiva.com/22743/1678782-22743915.pdf; ComponentLink3Description: https://datasheet.ciiva.com/22743/1678782-22743915.pdf; ComponentLink4URL: https://datasheet.ciiva.com/22722/1678782-22722140.pdf; ComponentLink4Description: https://datasheet.ciiva.com/22722/1678782-22722140.pdf; ComponentLink5URL: https://datasheet.ciiva.com/46375/1678782-46375549.pdf; ComponentLink5Description: https://datasheet.ciiva.com/46375/1678782-46375549.pdf; ComponentLink6URL: https://datasheet.ciiva.com/46375/1678782-46375550.pdf; ComponentLink6Description: https://datasheet.ciiva.com/46375/1678782-46375550.pdf; ComponentLink7URL: https://datasheet.ciiva.com/9184/aoa0000ce2-9184239.pdf; ComponentLink7Description: https://datasheet.ciiva.com/9184/aoa0000ce2-9184239.pdf
R33 = RES_0805_549K: RES SMD 549K OHM 1% 1/8W 0805; Manufacturer: Vishay; Manufacturer Part Number: CRCW0805549KFKEA; Resistance: 549KR; Power Rating: 125mW; Voltage Rating: 150V; Temperature Coefficient: 100ppm/°C; Supplier 1: Digi-Key; Supplier Part Number 1: 541-549KCCT-ND; Stock 1: 25548; Pricing 1: 1=0.1, 10=0.046, 100=0.0187, 1000=0.0084, 2500=0.0073 (USD); Case/Package: 0805; Number of Pins: 2; Weight: 0.000194oz; Case Code (Imperial): 0805; Case Code (Metric): 2012; Contact Plating: Tin; Min Operating Temperature: -55°C; Max Operating Temperature: 155°C; Tolerance: 1%; Packaging: Tape and Reel; Package Quantity: 10; Composition: Thick Film; Number of Terminations: 2; Military Standard: Not; Max Power Dissipation: 125mW; Voltage Rating (DC): 150V; Length: 2mm; Height: 0.02inch; Width: 1.25mm; Depth: 1.25mm; Radiation Hardening: No; REACH SVHC: Unknown; Lead Free: Lead Free; ComponentLink1URL: https://datasheet.ciiva.com/7670/1697337-7670905.pdf; ComponentLink1Description: https://datasheet.ciiva.com/7670/1697337-7670905.pdf; ComponentLink2URL: https://datasheet.ciiva.com/7670/1697337-7670906.pdf; ComponentLink2Description: https://datasheet.ciiva.com/7670/1697337-7670906.pdf; ComponentLink3URL: https://datasheet.ciiva.com/8929/dcrcwe3-8929562.pdf; ComponentLink3Description: https://datasheet.ciiva.com/8929/dcrcwe3-8929562.pdf; ComponentLink4URL: https://datasheet.ciiva.com/2467/dcrcwe3-2467947.pdf; ComponentLink4Description: https://datasheet.ciiva.com/2467/dcrcwe3-2467947.pdf; ComponentLink5URL: https://datasheet.ciiva.com/2467/dcrcwe3-2467948.pdf; ComponentLink5Description: https://datasheet.ciiva.com/2467/dcrcwe3-2467948.pdf; ComponentLink6URL: https://datasheet.ciiva.com/2467/dcrcwe3-2467949.pdf; ComponentLink6Description: https://datasheet.ciiva.com/2467/dcrcwe3-2467949.pdf; ComponentLink7URL: https://datasheet.ciiva.com/7726/66915-7726014.pdf; ComponentLink7Description: https://datasheet.ciiva.com/7726/66915-7726014.pdf; ComponentLink8URL: https://datasheet.ciiva.com/8929/dcrcwe3-8929566.pdf; ComponentLink8Description: https://datasheet.ciiva.com/8929/dcrcwe3-8929566.pdf; ComponentLink9URL: https://datasheet.ciiva.com/16392/dcrcwe3-16392334.pdf; ComponentLink9Description: https://datasheet.ciiva.com/16392/dcrcwe3-16392334.pdf; ComponentLink10URL: https://datasheet.ciiva.com/22683/1847332-22683326.pdf; ComponentLink10Description: https://datasheet.ciiva.com/22683/1847332-22683326.pdf
R34 R43 = RES_0805_11.8K: RES SMD 11.8K OHM 1% 1/8W 0805; Manufacturer: Yageo; Manufacturer Part Number: RC0805FR-0711K8L; Resistance: 11.8KR; Temperature Coefficient: 100ppm/°C; Voltage Rating (DC): 150V; Power Rating: 125mW; Supplier 1: Digi-Key; Supplier Part Number 1: 311-11.8KCRCT-ND; Stock 1: 69614; Pricing 1: 1=0.1, 10=0.022, 100=0.0088, 1000=0.004, 2500=0.0034 (USD); Case/Package: 0805; Contact Plating: Tin,Lead,Matte; Case Code (Metric): 2012; Case Code (Imperial): 0805; Min Operating Temperature: -55°C; Max Operating Temperature: 155°C; Tolerance: 1%; Packaging: Tape and Reel; Composition: Thick Film; Voltage Rating: 150V; Termination: SMD/SMT; Military Standard: Not; Package Quantity: 1; Number of Terminations: 2; Max Power Dissipation: 125mW; Length: 2mm; Height: 0.024inch; Width: 0.049inch; Depth: 1.25mm; Radiation Hardening: No; Lead Free: Lead Free; ComponentLink1URL: https://datasheet.ciiva.com/15189/getdatasheetpartid-498796-15189893.pdf; ComponentLink1Description: https://datasheet.ciiva.com/15189/getdatasheetpartid-498796-15189893.pdf; ComponentLink2URL: https://datasheet.ciiva.com/2509/pyu-r-int-thick-7-2509453.pdf; ComponentLink2Description: https://datasheet.ciiva.com/2509/pyu-r-int-thick-7-2509453.pdf; ComponentLink3URL: https://datasheet.ciiva.com/2509/pyu-r-int-thick-7-2509454.pdf; ComponentLink3Description: https://datasheet.ciiva.com/2509/pyu-r-int-thick-7-2509454.pdf; ComponentLink4URL: https://datasheet.ciiva.com/2509/pyu-r-int-thick-7-2509455.pdf; ComponentLink4Description: https://datasheet.ciiva.com/2509/pyu-r-int-thick-7-2509455.pdf
R35 R36 R46 R48 = RES_0805_787: RES SMD 787 OHM 1% 1/8W 0805; Manufacturer: Yageo; Manufacturer Part Number: RC0805FR-07787RL; Resistance: 787R; Max Power Dissipation: 125mW; Temperature Coefficient: 100ppm/°C; Voltage Rating (DC): 150V; Supplier 1: Digi-Key; Stock 1: 69458; Pricing 1: 1=0.1, 10=0.022, 100=0.0088, 1000=0.004, 2500=0.0034 (USD); Case/Package: 0805; Case Code (Metric): 2012; Case Code (Imperial): 0805; Min Operating Temperature: -55°C; Max Operating Temperature: 155°C; Package Quantity: 1; Tolerance: 1%; Packaging: Tape and Reel; Composition: Thick Film; Number of Terminations: 2; Power Rating: 125mW; Voltage Rating: 150V; Termination: SMD/SMT; Military Standard: Not; Length: 0.079inch; Height: 0.024inch; Width: 0.049inch; Depth: 1.25mm; Lead Free: Lead Free; ComponentLink1URL: https://datasheet.ciiva.com/2457/pyu-r-int-thick-7-2457920.pdf; ComponentLink1Description: https://datasheet.ciiva.com/2457/pyu-r-int-thick-7-2457920.pdf; ComponentLink2URL: https://datasheet.ciiva.com/2457/pyu-r-int-thick-7-2457921.pdf; ComponentLink2Description: https://datasheet.ciiva.com/2457/pyu-r-int-thick-7-2457921.pdf; ComponentLink3URL: https://datasheet.ciiva.com/2457/pyu-r-int-thick-7-2457922.pdf; ComponentLink3Description: https://datasheet.ciiva.com/2457/pyu-r-int-thick-7-2457922.pdf; ComponentLink4URL: https://datasheet.ciiva.com/12656/rc0805-12656894.pdf; ComponentLink4Description: https://datasheet.ciiva.com/12656/rc0805-12656894.pdf; Supplier Part Number 1: 311-787CRCT-ND
R38 = RES_0805_5.23K: Thick Film Resistors 5.23K OHM 1%; Manufacturer: Yageo; Manufacturer Part Number: RC0805FR-075K23L; Resistance: 5.23KR; Power Rating: 125mW; Voltage Rating: 150V; Temperature Coefficient: 100ppm/°C; Supplier 1: Digi-Key; Supplier Part Number 1: 311-5.23KCRCT-ND; Stock 1: 101854; Pricing 1: 1=0.1, 10=0.022, 100=0.0088, 1000=0.004, 2500=0.0034 (USD); Case/Package: 0805; Weight: 0.000194oz; Case Code (Imperial): 0805; Case Code (Metric): 2012; Contact Plating: Tin,Matte; Min Operating Temperature: -55°C; Max Operating Temperature: 155°C; Tolerance: 1%; Packaging: Tape and Reel; Termination: SMD/SMT; Composition: Thick Film; Military Standard: Not; Voltage Rating (DC): 150V; Length: 2mm; Height: 0.5mm; Width: 1.25mm; Depth: 1.25mm; Radiation Hardening: No; Lead Free: Lead Free; ComponentLink1URL: https://datasheet.ciiva.com/12577/rc0805-12577289.pdf; ComponentLink1Description: https://datasheet.ciiva.com/12577/rc0805-12577289.pdf
R41 = RES_0805_100K: Res Thick Film 0805 100K Ohm 1% 0.125W(1/8W) ±100ppm/C Molded SMD Automotive Punched T/R; Manufacturer: Panasonic ECG; Manufacturer Part Number: ERJ-6ENF1003V; Resistance: 100KR; Power Rating: 125mW; Temperature Coefficient: 100ppm/°C; Voltage Rating (DC): 150V; Supplier 1: Digi-Key; Supplier Part Number 1: P100KCCT-ND; Stock 1: 219769; Pricing 1: 1=0.1, 10=0.041, 100=0.0167, 1000=0.0075, 2500=0.0065 (USD); Mount: Surface Mount; Case/Package: 0805; Number of Pins: 2; Case Code (Metric): 2012; Case Code (Imperial): 0805; Contact Plating: Tin; Min Operating Temperature: -55°C; Max Operating Temperature: 155°C; Tolerance: 1%; Packaging: Tape and Reel; Package Quantity: 1; Voltage Rating: 150V; Composition: Thick Film; Number of Terminations: 2; Military Standard: Not; Termination: SMD/SMT; Max Power Dissipation: 125mW; Length: 2mm; Height: 0.6mm; Width: 0.049inch; Depth: 1.25mm; Radiation Hardening: No; REACH SVHC: No SVHC; Lead Free: Lead Free; ComponentLink1URL: https://datasheet.ciiva.com/11821/0900766b80f80784-11821507.pdf; ComponentLink1Description: https://datasheet.ciiva.com/11821/0900766b80f80784-11821507.pdf; ComponentLink2URL: https://datasheet.ciiva.com/22723/426256-22723909.pdf; ComponentLink2Description: https://datasheet.ciiva.com/22723/426256-22723909.pdf; ComponentLink3URL: https://datasheet.ciiva.com/46419/1678782-46419877.pdf; ComponentLink3Description: https://datasheet.ciiva.com/46419/1678782-46419877.pdf; ComponentLink4URL: https://datasheet.ciiva.com/27055/1988989-27055734.pdf; ComponentLink4Description: https://datasheet.ciiva.com/27055/1988989-27055734.pdf; ComponentLink5URL: https://datasheet.ciiva.com/16449/aoa0000ce2-16449480.pdf; ComponentLink5Description: https://datasheet.ciiva.com/16449/aoa0000ce2-16449480.pdf; ComponentLink6URL: https://datasheet.ciiva.com/17208/aoa0000ce2-17208153.pdf; ComponentLink6Description: https://datasheet.ciiva.com/17208/aoa0000ce2-17208153.pdf; ComponentLink7URL: https://datasheet.ciiva.com/22667/1678782-22667897.pdf; ComponentLink7Description: https://datasheet.ciiva.com/22667/1678782-22667897.pdf; ComponentLink8URL: https://datasheet.ciiva.com/24023/aoa0000ce2-24023497.pdf; ComponentLink8Description: https://datasheet.ciiva.com/24023/aoa0000ce2-24023497.pdf; ComponentLink9URL: https://datasheet.ciiva.com/7830/426256-7830746.pdf; ComponentLink9Description: https://datasheet.ciiva.com/7830/426256-7830746.pdf; ComponentLink10URL: https://datasheet.ciiva.com/30257/aoa0000ce2-30257690.pdf; ComponentLink10Description: https://datasheet.ciiva.com/30257/aoa0000ce2-30257690.pdf; ComponentLink11URL: https://datasheet.ciiva.com/7830/426256-7830988.pdf; ComponentLink11Description: https://datasheet.ciiva.com/7830/426256-7830988.pdf; ComponentLink12URL: https://datasheet.ciiva.com/16776/70260748-16776892.pdf; ComponentLink12Description: https://datasheet.ciiva.com/16776/70260748-16776892.pdf; ComponentLink13URL: https://datasheet.ciiva.com/16788/70260748-16788734.pdf; ComponentLink13Description: https://datasheet.ciiva.com/16788/70260748-16788734.pdf; ComponentLink14URL: https://datasheet.ciiva.com/48531/aoa0000ce2-48531486.pdf; ComponentLink14Description: https://datasheet.ciiva.com/48531/aoa0000ce2-48531486.pdf
R42 = RES_0805_1.13M: Res Thick Film 0805 1.13M Ohm 1% 1/8W 100ppm/C Molded SMD Punched Carrier T/R; Manufacturer: Panasonic; Manufacturer Part Number: ERJ-6ENF1134V; Resistance: 1.13MR; Power Rating: 125mW; Voltage Rating: 150V; Temperature Coefficient: 100ppm/°C; Supplier 1: Digi-Key; Supplier Part Number 1: P1.13BTCT-ND; Stock 1: 8396; Pricing 1: 1=0.1, 10=0.041, 100=0.0167, 1000=0.0075, 2500=0.0065 (USD); Mount: Surface Mount; Case/Package: 0805; Case Code (Metric): 2012; Case Code (Imperial): 0805; Contact Plating: Tin; Min Operating Temperature: -55°C; Max Operating Temperature: 155°C; Tolerance: 1%; Packaging: Tape and Reel; Package Quantity: 5000; Composition: Thick Film; Number of Terminations: 2; Termination: SMD/SMT; Max Power Dissipation: 125mW; Voltage Rating (DC): 150V; Length: 0.079inch; Height: 0.028inch; Width: 0.049inch; REACH SVHC: No SVHC; Lead Free: Lead Free; ComponentLink1URL: https://datasheet.ciiva.com/46446/1678782-46446917.pdf; ComponentLink1Description: https://datasheet.ciiva.com/46446/1678782-46446917.pdf; ComponentLink2URL: https://datasheet.ciiva.com/24066/aoa0000ce2-24066135.pdf; ComponentLink2Description: https://datasheet.ciiva.com/24066/aoa0000ce2-24066135.pdf; ComponentLink3URL: https://datasheet.ciiva.com/9198/aoa0000ce2-9198600.pdf; ComponentLink3Description: https://datasheet.ciiva.com/9198/aoa0000ce2-9198600.pdf; ComponentLink4URL: https://datasheet.ciiva.com/22757/1678782-22757053.pdf; ComponentLink4Description: https://datasheet.ciiva.com/22757/1678782-22757053.pdf; ComponentLink5URL: https://datasheet.ciiva.com/22743/1678782-22743119.pdf; ComponentLink5Description: https://datasheet.ciiva.com/22743/1678782-22743119.pdf
R44 = RES_0805_255K: RES SMD 255K OHM 1% 1/8W 0805; Manufacturer: Yageo; Manufacturer Part Number: RC0805FR-07255KL; Power Rating: 125mW; Resistance: 255KR; Voltage Rating: 150V; Temperature Coefficient: 100ppm/°C; Supplier 1: Digi-Key; Supplier Part Number 1: 311-255KCRCT-ND; Stock 1: 81508; Pricing 1: 1=0.1, 10=0.022, 100=0.0088, 1000=0.004, 2500=0.0034 (USD); Case/Package: 0805; Case Code (Imperial): 0805; Case Code (Metric): 2012; Min Operating Temperature: -55°C; Max Operating Temperature: 155°C; Packaging: Tape and Reel; Tolerance: 1%; Package Quantity: 1; Termination: SMD/SMT; Composition: Thick Film; Number of Terminations: 2; Military Standard: Not; Max Power Dissipation: 125mW; Voltage Rating (DC): 150V; Length: 2mm; Height: 0.024inch; Width: 1.25mm; Depth: 1.25mm; Lead Free: Lead Free; ComponentLink1URL: https://datasheet.ciiva.com/12560/rc0805-257173-12560696.pdf; ComponentLink1Description: https://datasheet.ciiva.com/12560/rc0805-257173-12560696.pdf; ComponentLink2URL: https://datasheet.ciiva.com/2457/pyu-r-int-thick-7-2457386.pdf; ComponentLink2Description: https://datasheet.ciiva.com/2457/pyu-r-int-thick-7-2457386.pdf; ComponentLink3URL: https://datasheet.ciiva.com/2457/pyu-r-int-thick-7-2457387.pdf; ComponentLink3Description: https://datasheet.ciiva.com/2457/pyu-r-int-thick-7-2457387.pdf; ComponentLink4URL: https://datasheet.ciiva.com/2457/pyu-r-int-thick-7-2457388.pdf; ComponentLink4Description: https://datasheet.ciiva.com/2457/pyu-r-int-thick-7-2457388.pdf; ComponentLink5URL: https://datasheet.ciiva.com/17419/rc0805-17419887.pdf; ComponentLink5Description: https://datasheet.ciiva.com/17419/rc0805-17419887.pdf
R45 = RES_0805_887K: Thick Film Resistors - SMD 887K OHM 1%; Manufacturer: Yageo; Manufacturer Part Number: RC0805FR-07887KL; Voltage Rating (DC): 150V; Power Rating: 125mW; Resistance: 887KR; Temperature Coefficient: 100ppm/°C; Supplier 1: Digi-Key; Supplier Part Number 1: 311-887KCRCT-ND; Stock 1: 29855; Pricing 1: 1=0.1, 10=0.022, 100=0.0088, 1000=0.004, 2500=0.0034 (USD); Case/Package: 0805; Case Code (Imperial): 0805; Case Code (Metric): 2012; Contact Plating: Tin,Matte; Min Operating Temperature: -55°C; Max Operating Temperature: 155°C; Tolerance: 1%; Packaging: Tape and Reel; Voltage Rating: 150V; Termination: SMD/SMT; Composition: Thick Film; Military Standard: Not; Length: 2mm; Height: 0.5mm; Width: 1.25mm; Depth: 1.25mm; Radiation Hardening: No; Lead Free: Lead Free; ComponentLink1URL: http://components.arrow.com/part/dataview/0323_03541583; ComponentLink1Description: http://components.arrow.com/part/dataview/0323_03541583; ComponentLink2URL: http://www.yageo.ru/pdf/RC0805.pdf; ComponentLink2Description: http://www.yageo.ru/pdf/RC0805.pdf; ComponentLink3URL: http://www.yageo.com/documents/recent/PYu-RC_Group_51_RoHS_L_2.pdf; ComponentLink3Description: http://www.yageo.com/documents/recent/PYu-RC_Group_51_RoHS_L_2.pdf; ComponentLink4URL: http://www.yageo.com/documents/recent/PYu-RC0805_51_RoHS_L_5.pdf; ComponentLink4Description: http://www.yageo.com/documents/recent/PYu-RC0805_51_RoHS_L_5.pdf
TP2-TP9 = TP: Testpoint_0805; Manufacturer: TE Connectivity; Manufacturer Part Number: 1625854-2; Resistance: 0mR; Supplier 1: Digi-Key; Stock 1: 27299; Pricing 1: 1=0.21, 10=0.2, 25=0.1708, 50=0.1496, 100=0.1389, 250=0.1229, 500=0.1175, 1000=0.0962 (USD); Mount: Surface Mount; Case/Package: 0805; Colour: Natural; Min Operating Temperature: -55°C; Max Operating Temperature: 125°C; Packaging: Tape and Reel; Package Quantity: 2000; Military Standard: Not; Length: 2mm; Depth: 1.2mm; Radiation Hardening: No; Lead Free: Lead Free; ComponentLink1URL: https://datasheet.ciiva.com/6439/eng-ds-1773266-a-6439169.pdf; ComponentLink1Description: https://datasheet.ciiva.com/6439/eng-ds-1773266-a-6439169.pdf; ComponentLink2URL: https://datasheet.ciiva.com/30238/1773266-a-30238966.pdf; ComponentLink2Description: https://datasheet.ciiva.com/30238/1773266-a-30238966.pdf; ComponentLink3URL: https://datasheet.ciiva.com/8914/eng-ds-1773266-a-8914649.pdf; ComponentLink3Description: https://datasheet.ciiva.com/8914/eng-ds-1773266-a-8914649.pdf; Supplier Part Number 1: A106144CT-ND
U4 U6 = LMZ12003: POWER MODULE, TO-PMOD-7, FULL REEL; Manufacturer: Texas Instruments; Manufacturer Part Number: LMZ12003TZ-ADJ/NOPB; Min Input Voltage: 4.5V; Max Input Voltage: 20V; Number of Outputs: 1; Output Current: 3A; Output Voltage: 6V; Switching Frequency: 1MHz; Efficiency: 92%; Min Output Voltage: 800mV; Quiescent Current: 1mA; Max Power Dissipation: 18W; Supplier 1: Digi-Key; Stock 1: 0; Pricing 1: 1=9.05, 5=8.986, 10=8.918, 25=8.7804, 50=8.5062, 100=7.683 (USD); Mount: Surface Mount; Number of Pins: 8; Min Operating Temperature: -40°C; Max Operating Temperature: 125°C; Packaging: Tape and Reel; Package Quantity: 1; Voltage - Output 1: 6V; Max Output Current: 3A; Max Output Voltage: 6V; Length: 0.4inch; Height: 0.18inch; Width: 0.54inch; REACH SVHC: No SVHC; Lead Free: Lead Free; ComponentLink1URL: https://datasheet.ciiva.com/48695/001207013-da-01-en-ic-buc-lmz12003tz-adj-nopb-to-pmod-7-tid-48695238.pdf; ComponentLink1Description: https://datasheet.ciiva.com/48695/001207013-da-01-en-ic-buc-lmz12003tz-adj-nopb-to-pmod-7-tid-48695238.pdf; Supplier Part Number 1: LMZ12003TZ-ADJ/NOPBCT-ND
U5 U7 = TPS3779BDBVR: Voltage Detector, Active-Low, Push-Pull Reset, 2-Monitors, 1.5V-6.5Vin, SOT-23-6; Manufacturer: Texas Instruments; Manufacturer Part Number: TPS3779BDBVT; Number of Voltages Monitored: 2; Reset: Active Low; Threshold Voltage: 1.194V; Min Supply Voltage: 1.5V; Max Supply Voltage: 6.5V; Quiescent Current: 2uA; Supplier 1: Digi-Key; Supplier Part Number 1: 296-42165-1-ND; Stock 1: 495; Pricing 1: 1=1.82, 10=1.632, 100=1.312 (USD); Case/Package: SOT-23-6; Number of Pins: 6; Min Operating Temperature: -40°C; Max Operating Temperature: 125°C; Packaging: Tape and Reel; REACH SVHC: No SVHC; Lead Free: Lead Free; ComponentLink1URL: http://www.ti.com/general/docs/lit/getliterature.tsp?genericPartNumber=TPS3779&&fileType=pdf; ComponentLink1Description: http://www.ti.com/general/docs/lit/getliterature.tsp?genericPartNumber=TPS3779&&fileType=pdf